# EAGLE design ir (EAGLE 7.6.0)
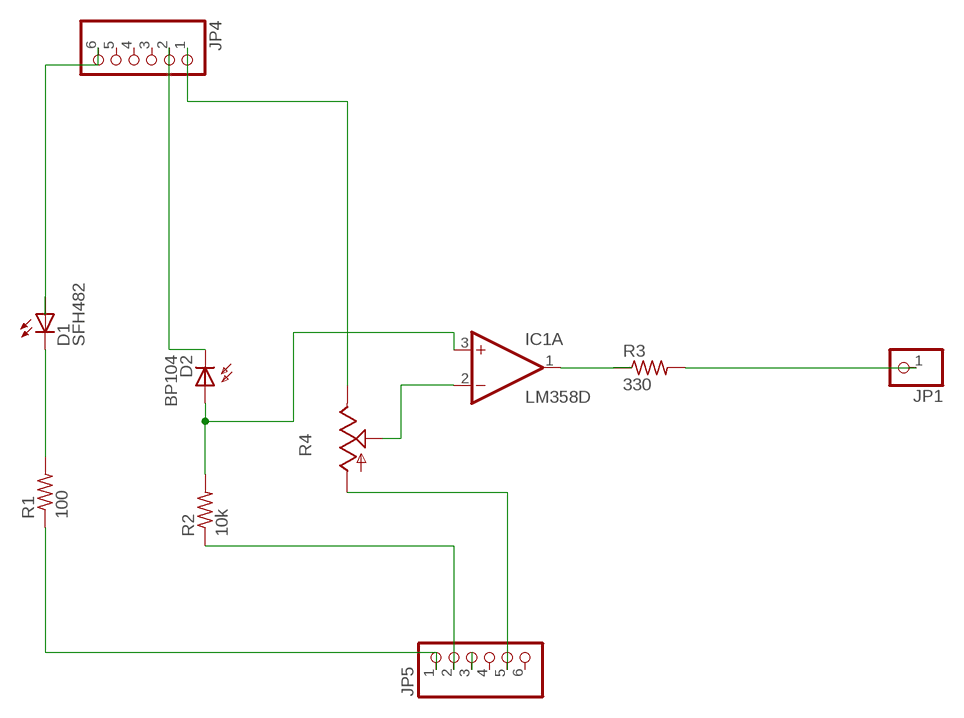
[diagram p0: schematic, sheet 1]

## Parts
D1  SFH482  [SFH482]
D2  BP104  [BP104]
IC1  LM358D  [SO08]
JP1  PINHD-1X1  [1X01]
JP4  PINHD-1X6  [1X06]
JP5  PINHD-1X6  [1X06]
R1  100  R-US_0204/7  [0204/7]
R2  10k  R-US_0204/7  [0204/7]
R3  330  R-US_0204/7  [0204/7]
R4  TRIM_US-3223G  [3223G]

## Nets
N$1: D2.K(C) JP4.2
N$2: D1.K(C) R1.2
N$3: JP5.1 R1.1
N$4: D2.A IC1.3(A:+IN) R2.2
N$5: JP5.5 R4.1(A)
N$6: IC1.1(A:OUT) R3.1
N$7: JP1.1 R3.2
N$8: D1.A JP4.6
N$9: JP5.3
N$10: JP4.1 R4.3(E)
N$11: IC1.2(A:-IN) R4.2(S)
N$12: JP5.2 R2.1
Unconnected: IC1.5(B:+IN) IC1.6(B:-IN) IC1.7(B:OUT) JP4.3 JP4.4 JP4.5 JP5.4 JP5.6

## Power pins joined to a net without a drawn wire
V+: IC1.8(P:V+)
V-: IC1.4(P:V-)

## Library data of the parts
D1 = led:SFH482: IR LED infrared emitting diode, Infineon
D2 = opto-trans-siemens:BP104: PHOTO DIODE; MF: VISHAY/TELEFUNKEN; MPN: BP104; OC_FARNELL: 1779636; OC_NEWARK: 14M4504
IC1 = linear:LM358: OP AMP also LM158; LM258; LM2904 Source: http://cache.national.com/ds/LM/LM158.pdf
JP1 = adafruit:PINHD-1X1: Pin header 1x1 for 0.1" spacing With round pins
JP4 JP5 = adafruit:PINHD-1X6: PIN HEADER
R1-R3 = adafruit:R-US_: RESISTOR, American symbol
R4 = pot:TRIM_US-: POTENTIOMETER

## Board
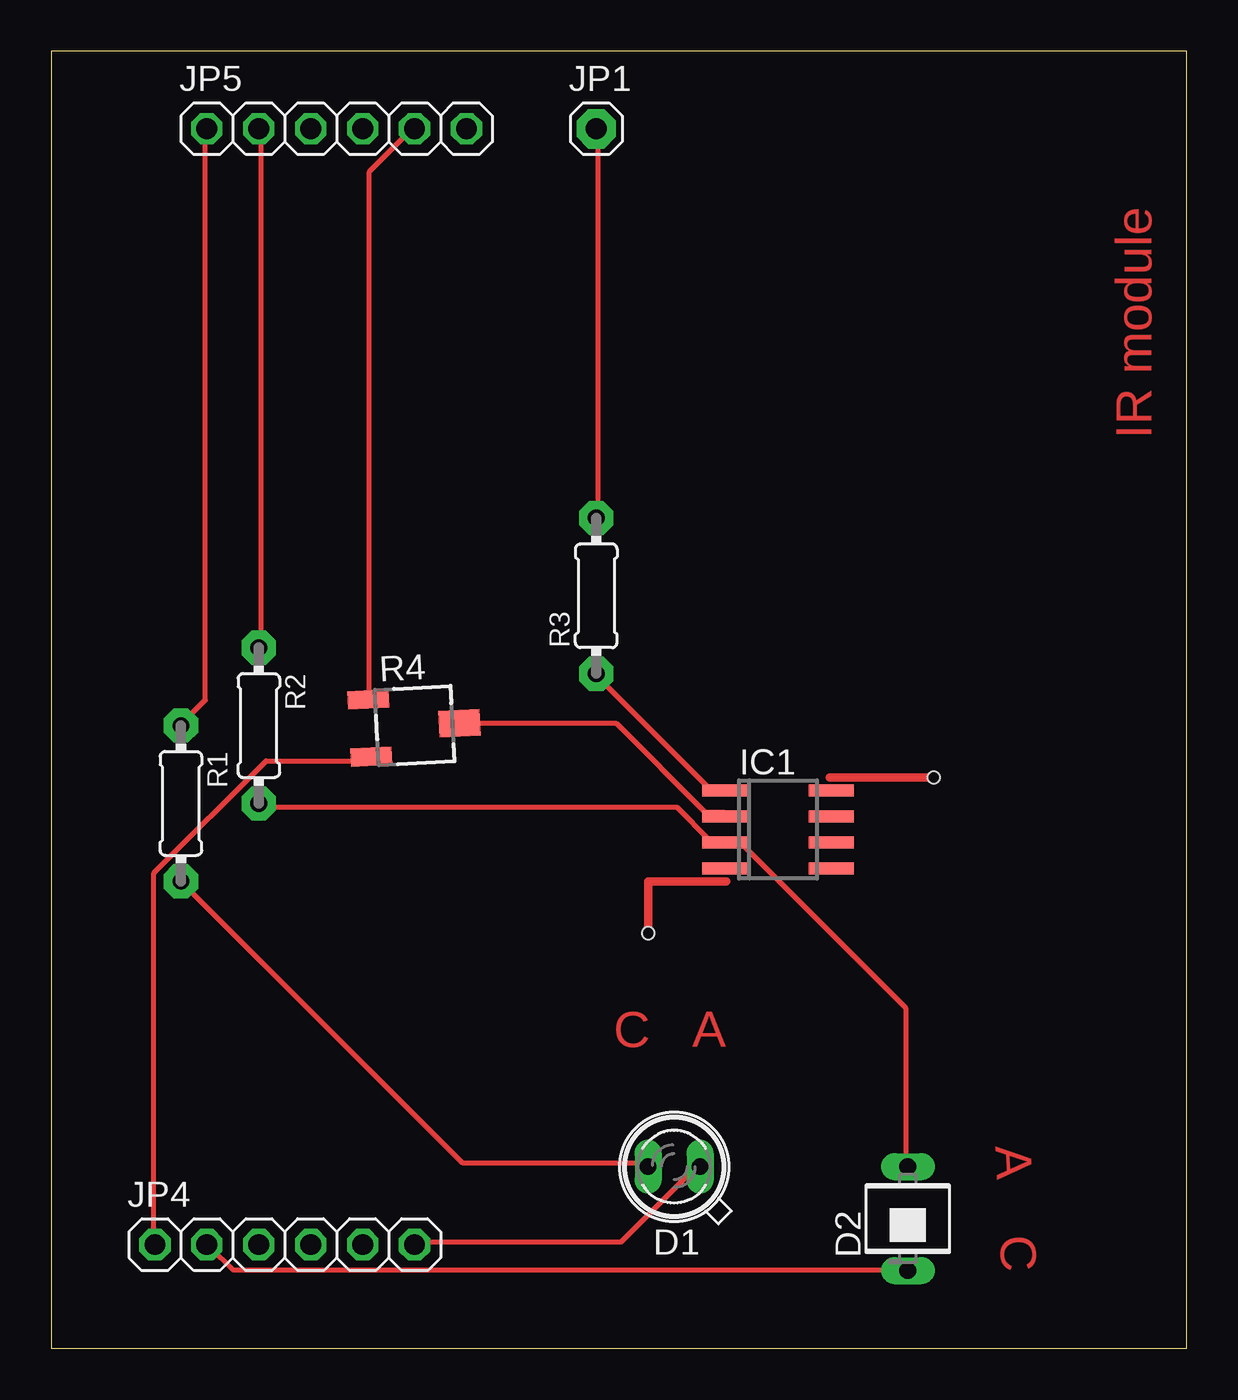
[diagram p1: board, top side]

Size 55.55 x 63.49 mm. Coordinates in mm from the lower left corner, seen from the top.
Outline: 0,0 55.55,0 55.55,63.49 0,63.49 0,0
Copper layers (1*16): Top 0.035mm / dielectric 1.5mm / Bottom 0.035mm
Design rules "default": minimum track width 10mil, minimum drill 24mil, track to track 8mil, track to pad 8mil, pad to pad 8mil, via to via 8mil, smd to smd 8mil, copper to edge 40mil, drill to drill 8mil, minimum pad ring 10mil, minimum via ring 8mil, stop-mask expansion 4mil, vias tented up to drill 0mil, thermal gap 10mil
Holes 0.6 mm at 29.21,20.32 43.18,27.94

### Footprints (pad centres in the part's own frame; a part is rotated, then mirrored left to right if it is on the bottom)
SFH482 = drill 0.813 long: A -1.27,0; K 1.27,0
BP104 = drill 0.813 long: A 0,2.54; K 0,-2.54
SO08 = smd 0.6 x 2.2: 1 -1.905,-2.6; 2 -0.635,-2.6; 3 0.635,-2.6; 4 1.905,-2.6; 5 1.905,2.6; 6 0.635,2.6; 7 -0.635,2.6; 8 -1.905,2.6
1X01 = drill 1.016 pad 1.93 octagon: 1 0,0
1X06 = drill 1.016 octagon: 1 -6.35,0; 2 -3.81,0; 3 -1.27,0; 4 1.27,0; 5 3.81,0; 6 6.35,0
0204/7 = drill 0.813 pad 1.676 octagon: 1 -3.81,0; 2 3.81,0
3223G = smd 2 x 0.9: 1 -2.2,1.4; 3 -2.2,-1.4 | smd 2 x 1.3: 2 2.2,0

### Placement (x,y rotation side)
D1  30.48,8.89 180 top
D2  41.91,6.35 0 top
IC1  35.56,25.4 270 top
JP1  26.67,59.69 0 top
JP4  11.43,5.08 0 top
JP5  13.97,59.69 0 top
R1  6.35,26.67 270 top
R2  10.16,30.48 270 top
R3  26.67,36.83 90 top
R4  17.78,30.48 3 top

### Tracks (layer width: path | path; a pad name or v marks a point on that pad's centre or on a via)
N$1
  Top 0.254: D2.K 41.83,3.83 8.91,3.83 7.77,4.98 JP4.2
N$2
  Top 0.254: R1.2 20.12,9.09 29.03,9.09 D1.K
N$3
  Top 0.254: JP5.1 7.54,59.61 7.54,31.72 6.4,30.58 R1.1
N$4
  Top 0.254: D2.A 41.83,9.09 41.83,16.64 33.83,24.64 33.15,24.64 IC1.3 32.92,24.87 32.23,24.87 30.63,26.47 10.29,26.47 R2.2
N$5
  Top 0.254: R4.1 15.54,31.95 15.54,57.56 17.6,59.61 JP5.5
N$6
  Top 0.254: IC1.1 32.92,27.38 32.23,27.38 26.75,32.87 R3.1
N$7
  Top 0.254: R3.2 26.75,40.64 26.75,59.61 JP1.1
N$8
  Top 0.254: D1.A 31.55,8.86 27.89,5.21 17.83,5.21 JP4.6
N$10
  Top 0.254: R4.3 15.54,28.75 10.52,28.75 5.03,23.27 5.03,5.21 JP4.1
N$11
  Top 0.254: R4.2 20.12,30.58 27.66,30.58 32,26.24 32.92,26.24 IC1.2
N$12
  Top 0.254: JP5.2 10.29,59.61 10.29,34.47 R2.1
N$13
  Top 0.406: 33.02,22.86 29.21,22.86 29.21,20.32
N$14
  Top 0.406: 38.1,27.94 43.18,27.94

### Text on the board
Top: IR module | C A | A C